# EAGLE design CR78-MB (EAGLE 7.6.0)
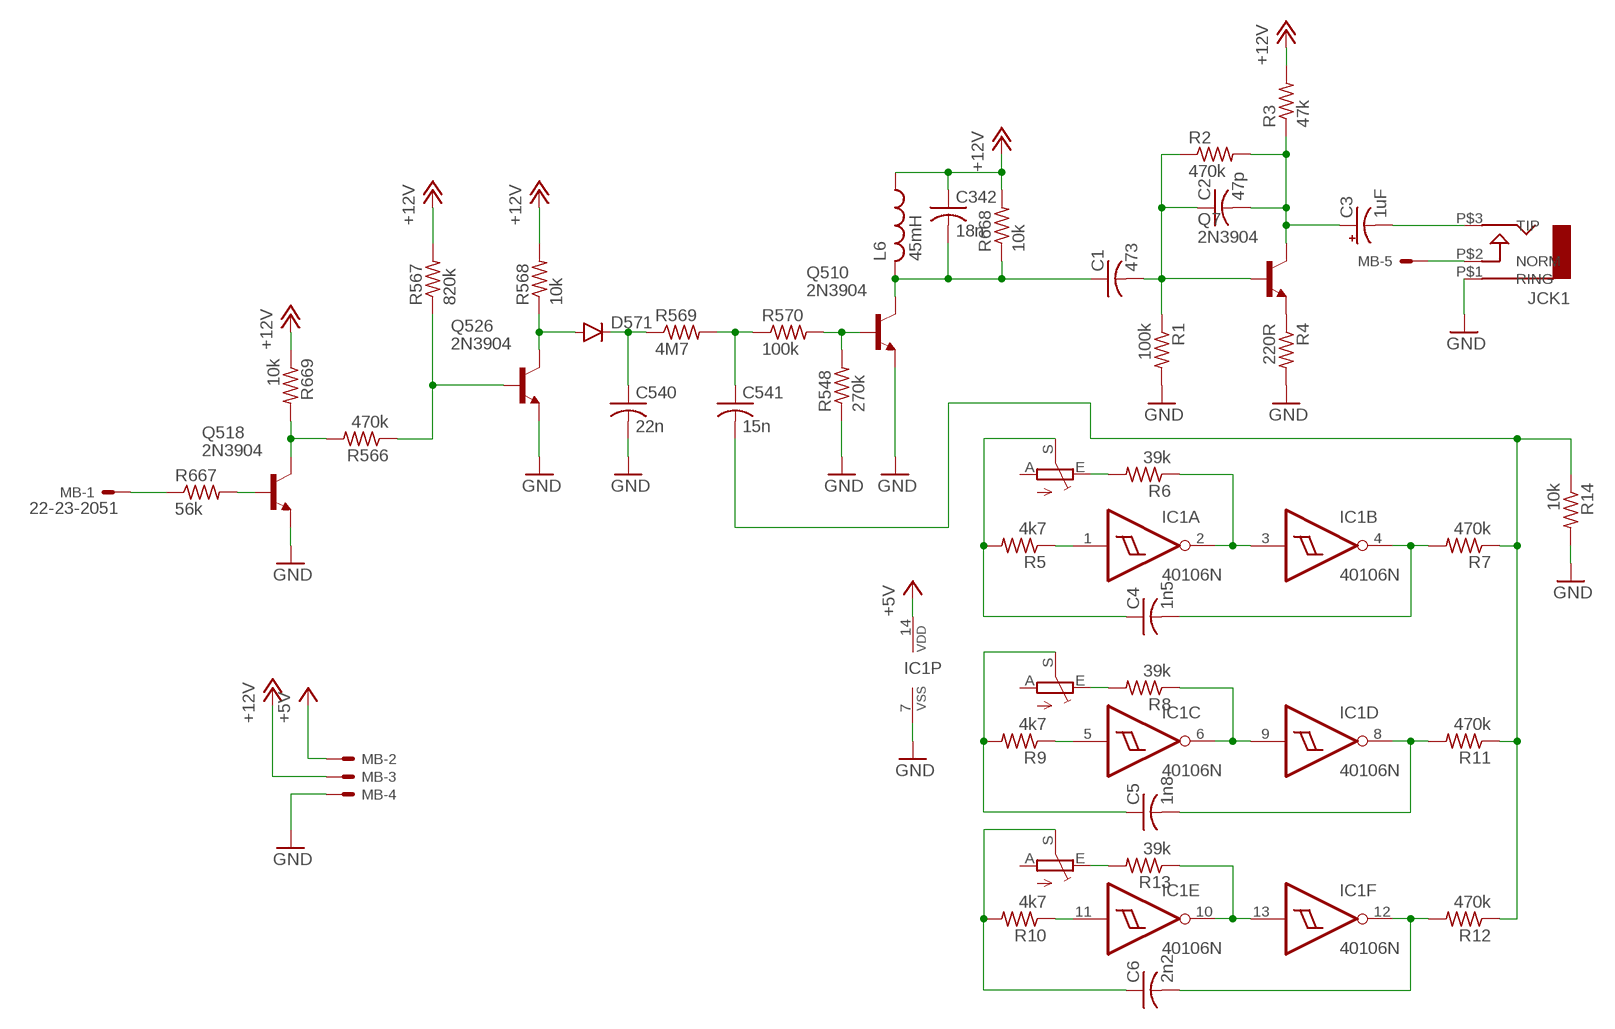
[diagram p0: schematic, sheet 1]

## Parts
C1  473  C-US050-025X075  [C050-025X075]
C2  47p  C-US025-030X050  [C025-030X050]
C3  1uF  CPOL-USB45181B  [B45181B]
C4  1n5  C-US050-025X075  [C050-025X075]
C5  1n8  C-US050-025X075  [C050-025X075]
C6  2n2  C-US050-025X075  [C050-025X075]
C342  18n  C-US050-025X075  [C050-025X075]
C540  22n  C-US050-025X075  [C050-025X075]
C541  15n  C-US050-025X075  [C050-025X075]
D571  DIODE1N4148  [DIODE-1N4148]
IC1  40106N  [DIL14]
JCK1  AUDIO-JACK  [ERTHENVAR-JACK-90DEG]
L6  45mH  L-US0204/5  [0204/5]
MB  22-23-2051  [22-23-2051]
Q7  2N3904  [TO92]
Q510  2N3904  [TO92]
Q518  2N3904  [TO92]
Q526  2N3904  [TO92]
R1  100k  R-US_0207/7  [0207/7]
R2  470k  R-US_0207/7  [0207/7]
R3  47k  R-US_0207/7  [0207/7]
R4  220R  R-US_0207/7  [0207/7]
R5  4k7  R-US_0207/7  [0207/7]
R6  39k  R-US_0207/7  [0207/7]
R7  470k  R-US_0207/7  [0207/7]
R8  39k  R-US_0207/7  [0207/7]
R9  4k7  R-US_0207/7  [0207/7]
R10  4k7  R-US_0207/7  [0207/7]
R11  470k  R-US_0207/7  [0207/7]
R12  470k  R-US_0207/7  [0207/7]
R13  39k  R-US_0207/7  [0207/7]
R14  10k  R-US_0207/7  [0207/7]
R548  270k  R-US_0207/7  [0207/7]
R566  470k  R-US_0207/7  [0207/7]
R567  820k  R-US_0207/7  [0207/7]
R568  10k  R-US_0207/7  [0207/7]
R569  4M7  R-US_0207/7  [0207/7]
R570  100k  R-US_0207/7  [0207/7]
R667  56k  R-US_0207/7  [0207/7]
R668  10k  R-US_0207/7  [0207/7]
R669  10k  R-US_0207/7  [0207/7]
VR1  20K  TRIM_EU-B64Y  [B64Y]
VR2  20K  TRIM_EU-B64Y  [B64Y]
VR3  20K  TRIM_EU-B64Y  [B64Y]

## Nets
+5V: IC1.14(P:VDD) MB.2
+12V: C342.1 L6.1 MB.3 R3.2 R567.2 R568.2 R668.2 R669.1
GND: C540.2 IC1.7(P:VSS) JCK1.P$1(RING) MB.4 Q510.3(E) Q518.3(E) Q526.3(E) R1.2 R4.2 R14.2 R548.1
N$1: D571.A Q526.1(C) R568.1
N$2: Q526.2(B) R566.1 R567.1
N$3: C541.2 R7.1 R11.1 R12.1 R14.1
N$4: C540.1 D571.C R569.1
N$5: IC1.2(A:O) IC1.3(B:I) R6.1
N$6: IC1.6(C:O) IC1.9(D:I) R8.1
N$7: JCK1.P$2(NORM) MB.5
N$8: IC1.5(C:I) R9.1
N$9: IC1.11(E:I) R10.1
N$10: IC1.10(E:O) IC1.13(F:I) R13.1
N$11: C5.2 IC1.8(D:O) R11.2
N$12: C541.1 R569.2 R570.1
N$13: Q510.2(B) R548.2 R570.2
N$14: C6.2 IC1.12(F:O) R12.2
N$15: Q7.3(E) R4.1
N$16: C2.2 C3.+ Q7.1(C) R2.2 R3.1
N$17: IC1.1(A:I) R5.1
N$18: C1.2 C2.1 Q7.2(B) R1.1 R2.1
N$19: C3.- JCK1.P$3(TIP)
N$20: Q518.1(C) R566.2 R669.2
N$21: Q518.2(B) R667.2
N$22: C4.2 IC1.4(B:O) R7.2
N$23: R6.2 VR1.E
N$24: MB.1 R667.1
N$25: R8.2 VR2.E
N$26: R13.2 VR3.E
N$27: C1.1 C342.2 L6.2 Q510.1(C) R668.1
N$28: C4.1 R5.2 VR1.S
N$29: C5.1 R9.2 VR2.S
N$30: C6.1 R10.2 VR3.S
Unconnected: VR1.A VR2.A VR3.A

## Library data of the parts
C1 C2 C4-C6 C342 C540 C541 = rcl:C-US: CAPACITOR, American symbol
C3 = rcl:CPOL-US: POLARIZED CAPACITOR, American symbol
D571 = SparkFun-DiscreteSemi:DIODE: Diode These are standard reverse protection diodes and small signal diodes. SMA package can handle up to about 1A. SOD-323 can handle about 200mA. What the SOD-323 package when ordering, there are some mfgs out there that are 5-pin packages.
IC1 = 40xx:40106: Hex SCHMITT TRIGGER
JCK1 = erthenvar:AUDIO-JACK: Switching Mono 3.5mm Audio Jack from Erthenvar.
L6 = rcl:L-US: INDUCTOR, American symbol
MB = con-molex:22-23-2051: .100" (2.54mm) Center Header - 5 Pin; MF: MOLEX; MPN: 22-23-2051; OC_FARNELL: 1462952; OC_NEWARK: 38C9178
Q7 Q510 Q518 Q526 = 808_lt:2N3904: NPN Transistor
R1-R14 R548 R566-R570 R667-R669 = rcl:R-US_: RESISTOR, American symbol
VR1-VR3 = TR808clone:TRIM_EU-: POTENTIOMETER

## Net classes
0 default: width 0.635 mm, drill 0.254 mm, clearance 0.254 mm
1 GND: width 1.016 mm, drill 1.016 mm, clearance 0.508 mm

## Board
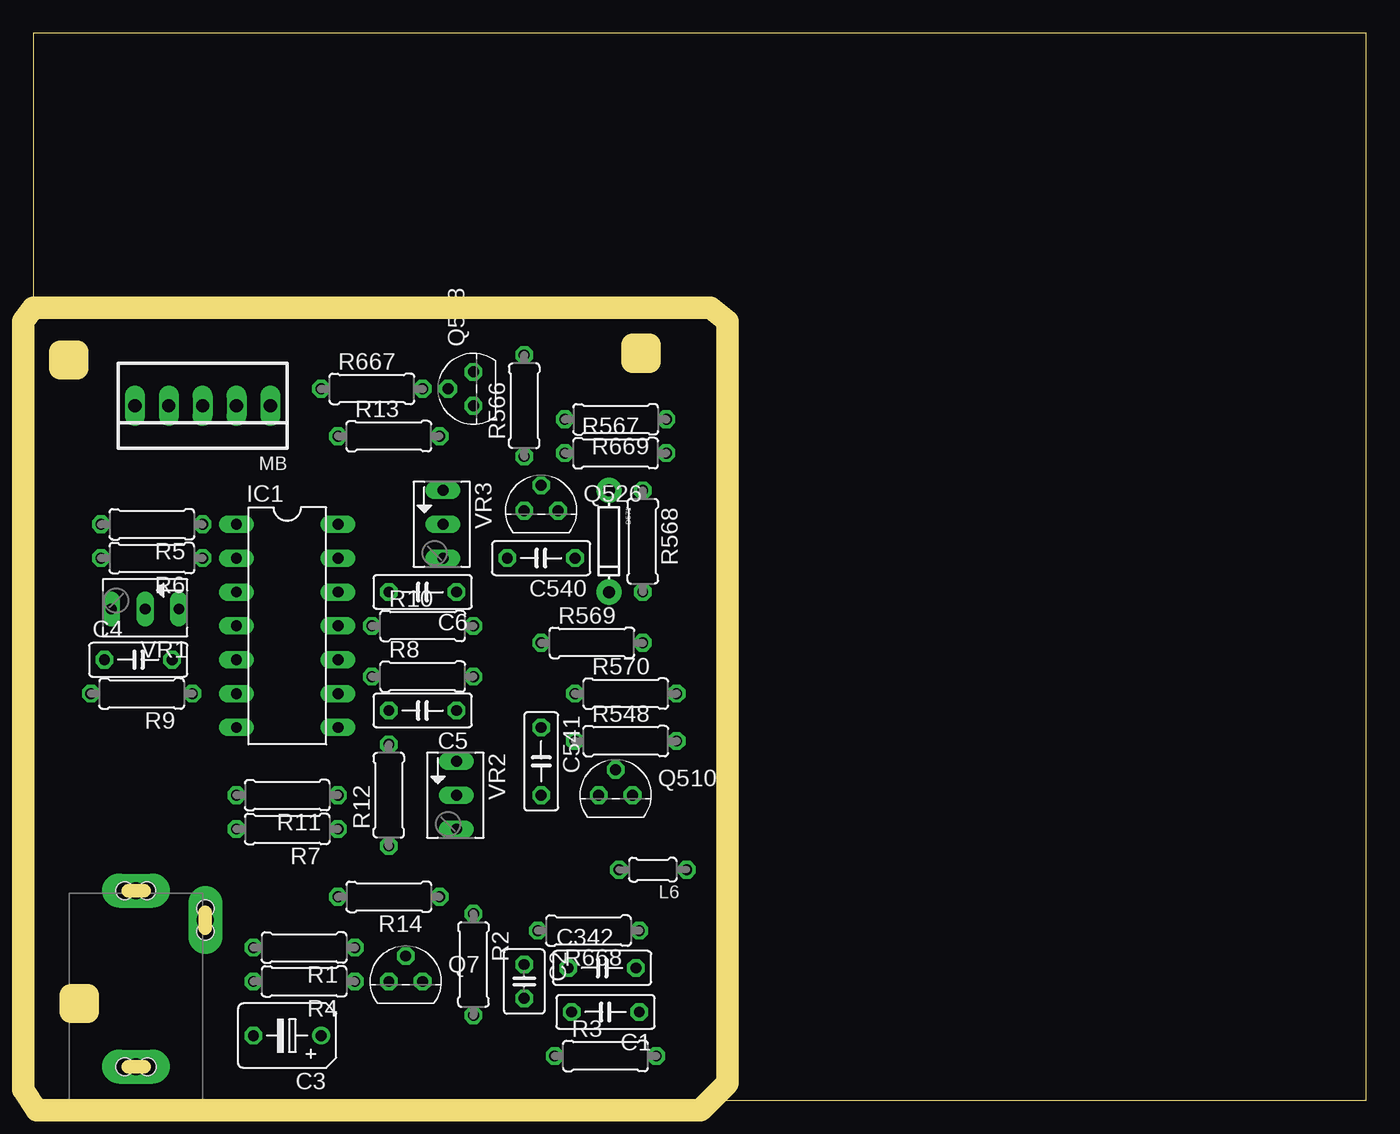
[diagram p1: board, top side]
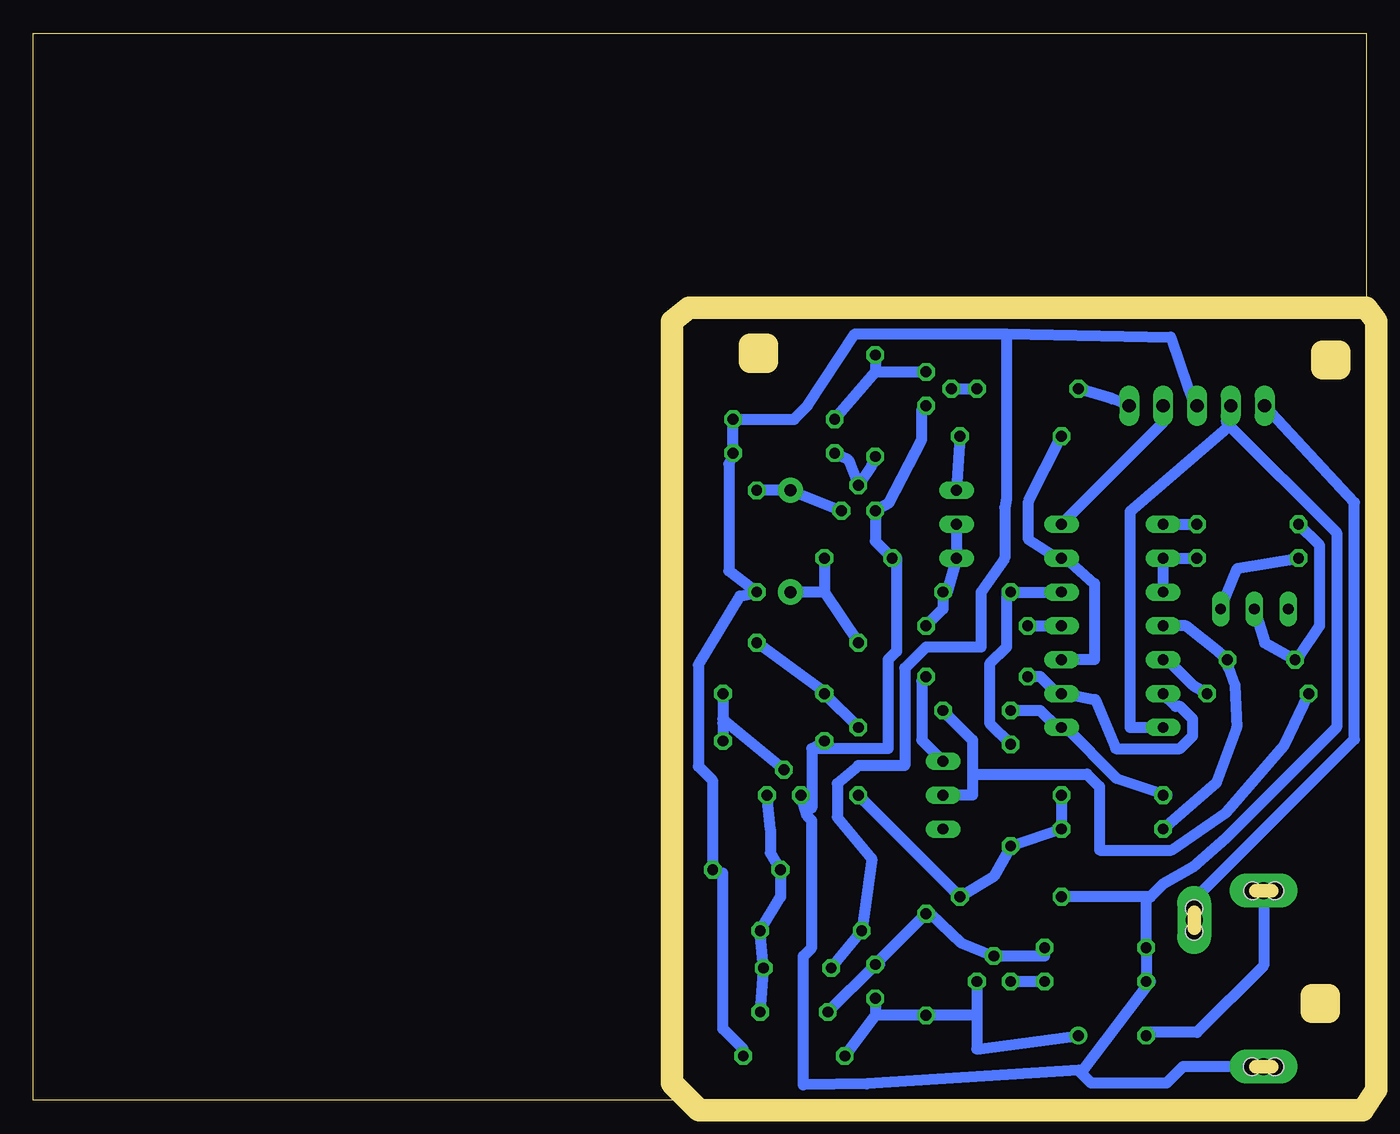
[diagram p2: board, bottom side, seen from below]

Size 100 x 80 mm. Coordinates in mm from the lower left corner, seen from the top.
Outline: 0,0 100,0 100,80 0,80 0,0
Copper layers (1*16): Top 0.035mm / dielectric 1.5mm / Bottom 0.035mm
Design rules "default *": minimum track width 32mil, minimum drill 31mil, track to track 18mil, track to pad 18mil, pad to pad 18mil, via to via 18mil, smd to smd 8mil, copper to edge 0mil, drill to drill 18mil, minimum pad ring 10mil, minimum via ring 8mil, stop-mask expansion 4mil, vias tented up to drill 0mil, thermal gap 10mil
Milling: 20 lines

### Footprints (pad centres in the part's own frame; a part is rotated, then mirrored left to right if it is on the bottom)
C050-025X075 = drill 0.813 octagon: 1 -2.54,0; 2 2.54,0
C025-030X050 = drill 0.813 octagon: 1 -1.27,0; 2 1.27,0
B45181B = drill 0.813: + -2.54,0 | drill 0.813 octagon: - 2.54,0
DIODE-1N4148 = drill 0.9 pad 1.88: A -3.81,0; C 3.81,0
DIL14 = drill 0.813 long: 1 -7.62,-3.81; 2 -5.08,-3.81; 3 -2.54,-3.81; 4 0,-3.81; 5 2.54,-3.81; 6 5.08,-3.81; 7 7.62,-3.81; 8 7.62,3.81; 9 5.08,3.81; 10 2.54,3.81; 11 0,3.81; 12 -2.54,3.81; 13 -5.08,3.81; 14 -7.62,3.81
ERTHENVAR-JACK-90DEG = drill 1.3 pad 2.54 long: P$1 5,-2.5; P$2 -0.2,-13.5; P$3 5,-15.7 | hole 1.3: 5.842,-2.489; 4.14,-2.489; -0.203,-12.649; -0.203,-14.351; 5.842,-15.697; 4.166,-15.697
0204/5 = drill 0.813 octagon: 1 -2.54,0; 2 2.54,0
22-23-2051 = drill 1 long: 1 -5.08,0; 2 -2.54,0; 3 0,0; 4 2.54,0; 5 5.08,0
TO92 = drill 0.813 octagon: 1 1.27,0; 2 0,1.905; 3 -1.27,0
0207/7 = drill 0.813 octagon: 1 -3.81,0; 2 3.81,0
B64Y = drill 0.813 long: A 2.54,0; E -2.54,0; S 0,0

### Placement (x,y rotation side)
C1  42.93,6.6 180 top
C2  36.83,8.89 270 top
C3  19.05,4.83 180 top
C4  7.87,33.02 0 top
C5  29.21,29.21 180 top
C6  29.21,38.1 180 top
C342  42.67,9.91 0 top
C540  38.1,40.64 180 top
C541  38.1,25.4 270 top
D571  43.18,41.91 270 top
IC1  19.05,35.56 270 top
JCK1  12.7,0 180 top
L6  46.48,17.27 180 top
MB  12.7,52.07 180 top
Q7  27.94,8.89 0 top
Q510  43.69,22.86 0 top
Q518  33.02,53.34 90 top
Q526  38.1,44.2 0 top
R1  20.32,11.43 180 top
R2  33.02,10.16 270 top
R3  42.93,3.3 0 top
R4  20.32,8.89 180 top
R5  8.89,43.18 180 top
R6  8.89,40.64 180 top
R7  19.05,20.32 180 top
R8  29.21,31.75 0 top
R9  8.13,30.48 180 top
R10  29.21,35.56 0 top
R11  19.05,22.86 180 top
R12  26.67,22.86 90 top
R13  26.67,49.78 0 top
R14  26.67,15.24 180 top
R548  44.45,26.92 0 top
R566  36.83,52.07 90 top
R567  43.69,48.51 0 top
R568  45.72,41.91 270 top
R569  41.91,34.29 0 top
R570  44.45,30.48 0 top
R667  25.4,53.34 0 top
R668  41.66,12.7 180 top
R669  43.69,51.05 180 top
VR1  8.38,36.83 180 top
VR2  31.75,22.86 270 top
VR3  30.73,43.18 270 top

### Tracks (layer width: path | path; a pad name or v marks a point on that pad's centre or on a via)
+5V
  Bottom 0.813: IC1.14 15.24,50.8 MB.2
+12V
  Bottom 0.813: C342.1 R668.2 37.08,18.1 39.69,21.21 39.69,23.75 38.1,25.08 34.61,25.08 34.61,32.38 33.02,33.97 28.89,33.97 28.89,38.1 27.11,40.64 27.11,44.45 26.99,45.09 26.99,57.47 | MB.3 12.83,51.94 13.34,53.34 14.67,57.21 26.99,57.47 | 26.99,57.47 38.35,57.47 41.91,52.07 42.93,51.05 R669.1 R567.2 47.82,47.69 47.82,39.69 R568.2 46.99,37.78 50.1,32.64 50.1,25.02 49.02,23.94 L6.1 48.26,17.02 48.26,5.33 46.74,3.81 R3.2
GND
  Bottom 0.813: 41.59,26.35 41.59,21.91 Q510.3 41.91,21.27 41.59,20.95 41.59,11.43 42.23,10.79 42.23,1.14 37.47,1.21 21.59,2.22 | R548.1 41.59,26.35 | Q518.3 33.34,51.75 33.34,49.53 35.81,44.77 Q526.3 36.83,41.91 C540.2 35.24,40.64 35.24,33.66 35.88,33.02 35.88,26.35 41.59,26.35 | 16.51,15.24 R14.2 | 16.51,15.24 R1.2 R4.2 16.19,8.89 21.27,2.22 21.59,2.22 | IC1.7 17.72,27.94 17.72,44.13 10.41,50.42 MB.4 10.48,50.8 2.22,42.55 2.22,27.94 10.48,19.68 13.02,17.46 15.24,16.19 16.19,15.24 16.51,15.24 | JCK1.P$1 13.76,2.5 14.99,1.27 20.64,1.27 21.59,2.22
N$1
  Bottom 0.813: Q526.1 D571.A R568.1
N$2
  Bottom 0.813: R566.1 37.08,47.62 Q526.2 38.86,48.01 R567.1
N$3
  Bottom 0.813: R11.1 R7.1 R12.1 27.94,16.76 R14.1 C541.2
N$4
  Bottom 0.813: 40.64,38.1 R569.1 | C540.1 40.64,38.1 | 40.64,38.1 D571.C
N$5
  Bottom 0.813: R6.1 IC1.2 IC1.3
N$6
  Bottom 0.813: IC1.6 14.29,29.53 13.97,29.53 13.02,28.57 13.02,27.3 13.97,26.35 18.8,26.35 20.32,30.04 22.54,30.48 IC1.9 23.18,30.48 24.45,31.75 R8.1
N$7
  Bottom 0.813: JCK1.P$2 12.9,15.04 0.89,27.05 0.89,44.83 MB.5
N$8
  Bottom 0.813: R9.1 12,30.54 13.02,31.11 14.92,33.02 IC1.5
N$9
  Bottom 0.813: R10.1 IC1.11
N$10
  Bottom 0.813: IC1.10 20.38,33.02 20.38,38.73 22.54,40.64 IC1.13 23.18,40.64 25.34,42.04 25.34,44.9 R13.1
N$11
  Bottom 0.813: R11.2 14.92,22.86 18.73,24.13 22.54,27.94 IC1.8 23.18,27.94 24.45,29.21 C5.2
N$12
  Bottom 0.813: C541.1 R570.1 40.96,30.48 40.96,30.8 R569.2
N$13
  Bottom 0.813: 48.1,28.42 48.26,28.57 R570.2 | 48.1,28.42 Q510.2 | R548.2 48.26,28.26 48.1,28.42
N$14
  Bottom 0.813: IC1.12 C6.2 26.99,38.1 26.99,33.97 28.26,32.7 28.26,28.26 R12.2
N$15
  Bottom 0.813: Q7.3 R4.1
N$16
  Bottom 0.813: 36.83,6.35 R3.1 | C2.2 36.83,6.35 | C3.+ 29.21,3.81 29.21,6.35 | Q7.1 29.21,6.35 | 29.21,6.35 R2.2 36.83,6.35
N$17
  Bottom 0.813: IC1.1 R5.1
N$18
  Bottom 0.813: R1.1 24.13,10.79 Q7.2 30.42,11.81 32.7,13.97 R2.1 36.51,10.48 36.51,10.16 C2.1 C1.2
N$19
  Bottom 0.813: JCK1.P$3 7.7,10.08 12.7,5.08 16.51,5.08 C3.-
N$20
  Bottom 0.813: 36.83,54.61 Q518.1 | R566.2 36.83,54.61 | 36.83,54.61 R669.2
N$21
  Bottom 0.813: Q518.2 R667.2
N$22
  Bottom 0.813: R7.2 11.24,23.81 9.72,27.94 9.84,31.11 10.35,32.45 C4.2 10.99,33.53 13.53,35.56 IC1.4
N$23
  Bottom 0.813: R6.2 9.65,39.88 VR1.E
N$24
  Bottom 0.813: R667.1 19.05,52.58 MB.1
N$25
  Bottom 0.813: VR2.E 33.34,26.99 33.34,31.43 R8.2
N$26
  Bottom 0.813: R13.2 VR3.E
N$27
  Bottom 0.813: 45.4,6.6 C1.1 45.21,10.16 C342.2 R668.1 43.94,15.24 L6.2 44.7,18.54 44.7,20.32 Q510.1
N$28
  Bottom 0.813: VR1.S 7.62,34.29 C4.1 5.02,33.27 3.49,35.56 3.49,41.59 R5.2
N$29
  Bottom 0.813: VR2.S 29.53,22.86 29.53,24.45 | 29.53,24.45 29.53,26.99 C5.1 | R9.2 6.16,26.61 10.48,21.59 14.61,18.73 20,18.73 20,23.5 20.95,24.45 29.53,24.45
N$30
  Bottom 0.813: R10.2 31.75,36.83 C6.1 31.43,38.1 30.67,40.7 VR3.S